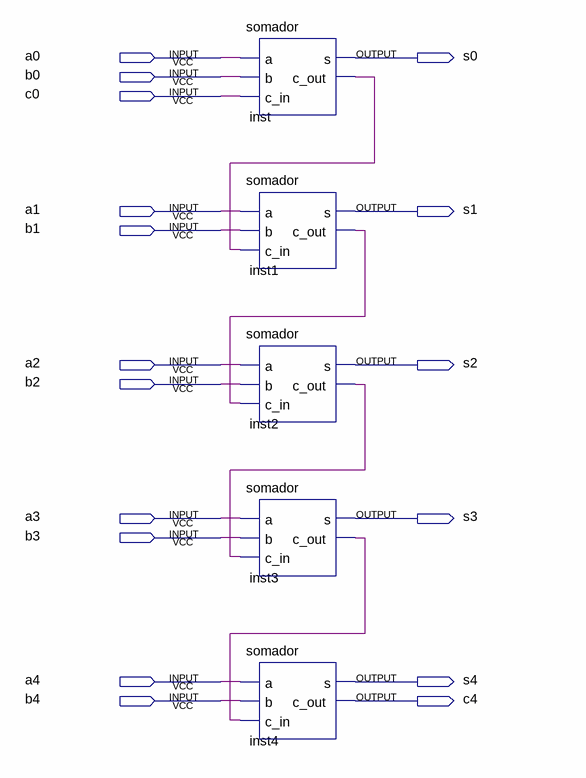
[diagram p0: schematic sheet]
// Quartus schematic somador_5bits.bdf as structural Verilog: 5 symbols, 17 pins
module somador_5bits (
  input  a0,
  input  b0,
  input  c0,
  input  a1,
  input  b1,
  input  a2,
  input  b2,
  input  a3,
  input  b3,
  input  a4,
  input  b4,
  output s0,
  output s1,
  output s2,
  output s3,
  output s4,
  output c4
);

  wire inst1_c_out, inst2_c_out, inst3_c_out, inst_c_out;

  somador inst (.a(a0), .b(b0), .c_in(c0), .s(s0), .c_out(inst_c_out));
  somador inst1 (.a(a1), .b(b1), .c_in(inst_c_out), .s(s1), .c_out(inst1_c_out));
  somador inst2 (.a(a2), .b(b2), .c_in(inst1_c_out), .s(s2), .c_out(inst2_c_out));
  somador inst3 (.a(a3), .b(b3), .c_in(inst2_c_out), .s(s3), .c_out(inst3_c_out));
  somador inst4 (.a(a4), .b(b4), .c_in(inst3_c_out), .s(s4), .c_out(c4));
endmodule
